# EAGLE schematic Logic Board (EAGLE 8.3.2)

## Sheet 1 of 2
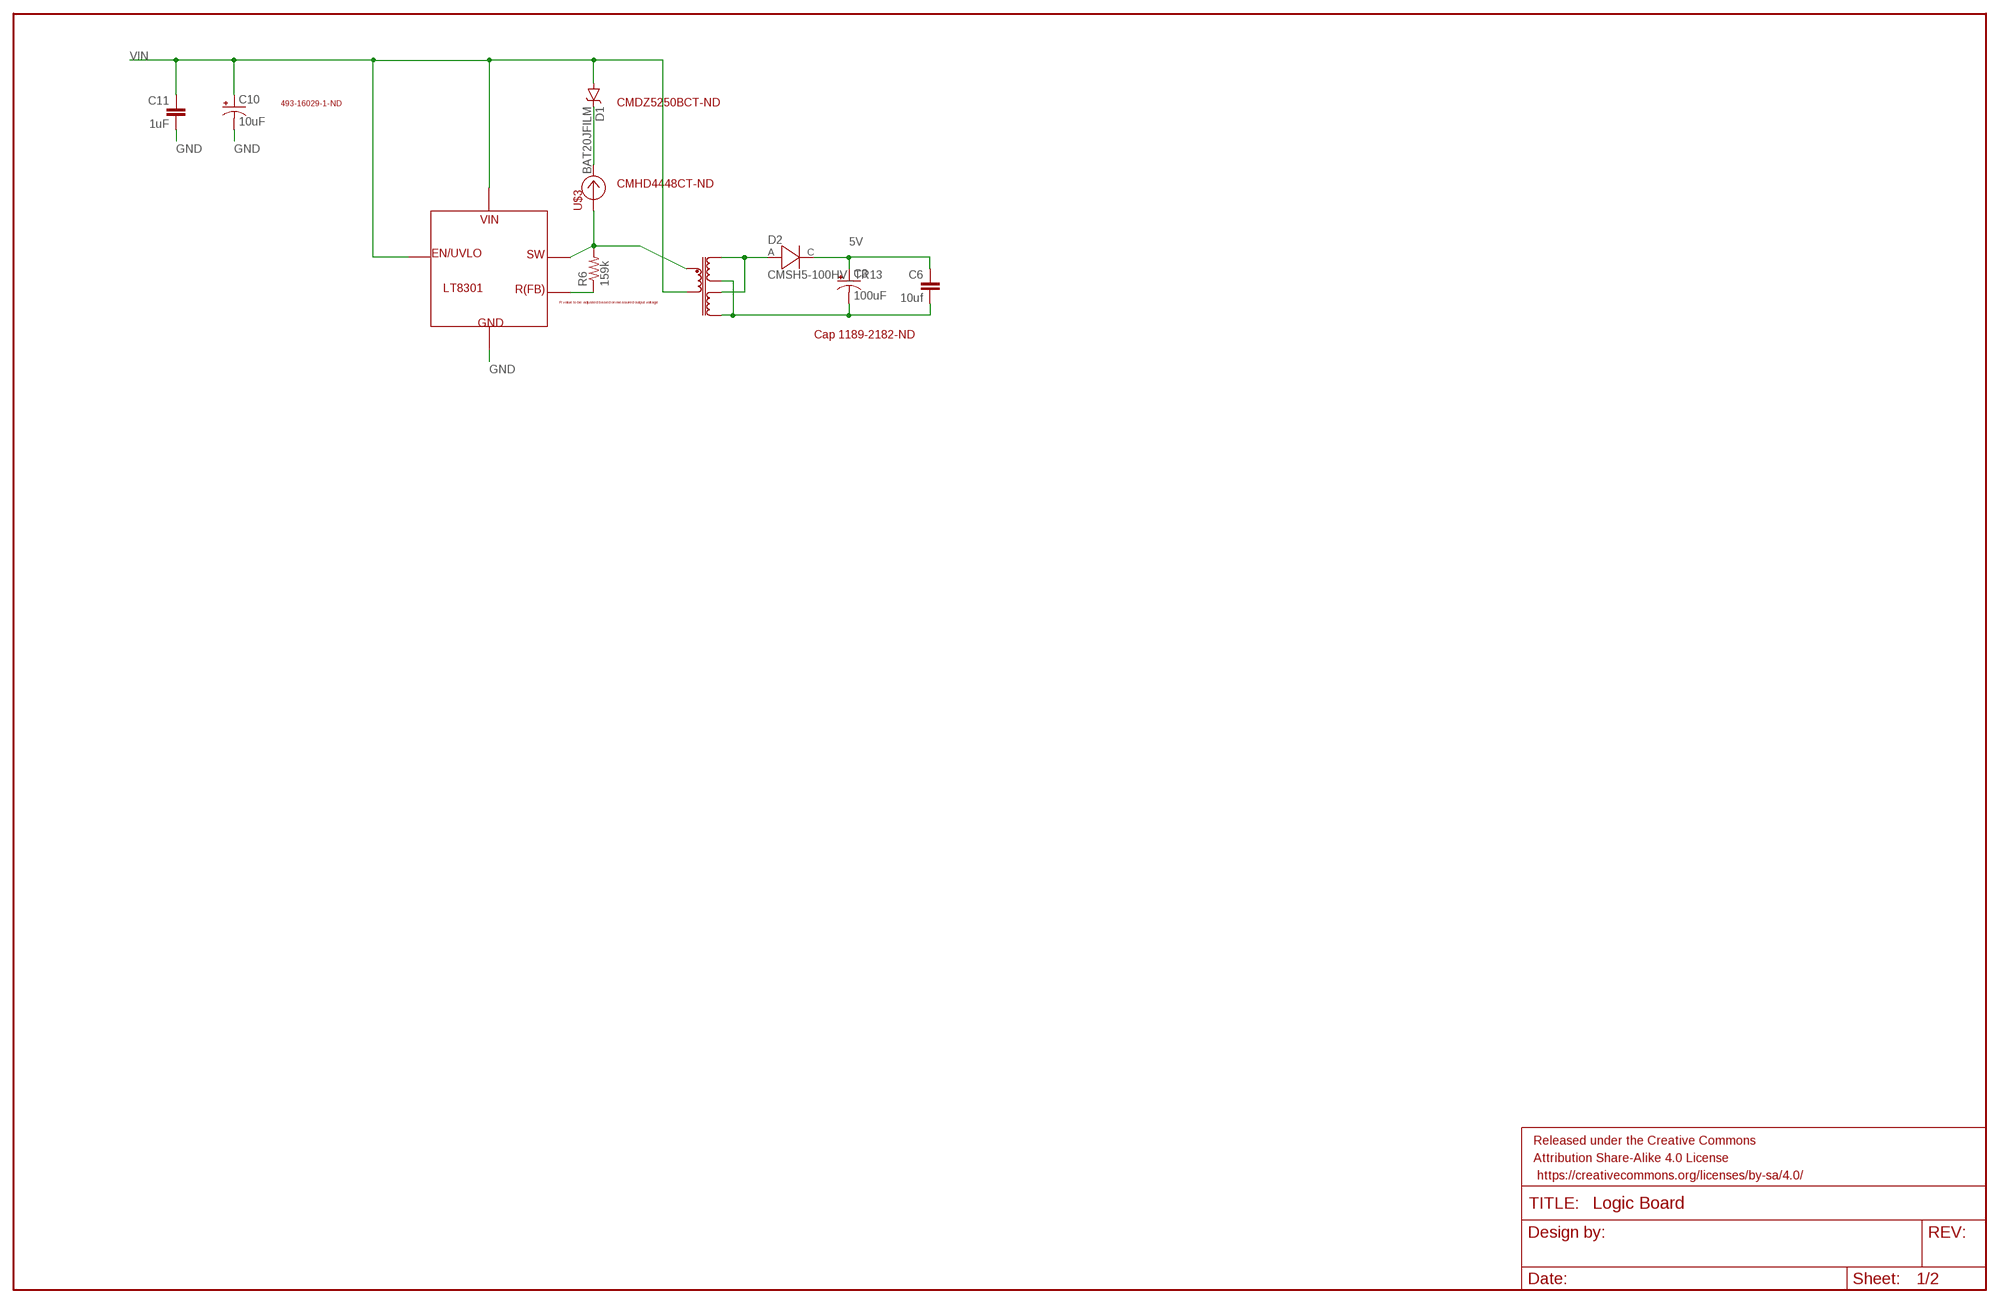
[diagram p0: schematic, sheet 1]

### Parts
C3  100uF  100UF-POLAR-RADIAL-2.5MM-25V-20%  [CPOL-RADIAL-2.5MM-6.5MM]
C6  10uf  C-EUC0805  [C0805]
C10  10uF  CAP_POLPTH1  [CPOL-RADIAL-100UF-25V]
C11  1uF  C-EUC0805  [C0805]
D1  BAT20JFILM  [SOD-323]
D2  CMSH5-100HV_TR13  [DIOM794X590X262L114X300N]
FRAME1  FRAME-LEDGER  [CREATIVE_COMMONS]
R6  159k  R-US_R0805  [R0805]
U$1  LT8301  [TSOT-23-5]
U$2  750313974  [750313974_TRANSFORMER]
U$3  AL5809-20S1-7  [SOD-123]

### Nets
5V: C3.1(+) C6.1 D2.C ; also sheet 2
GND: C10.2(-) C11.2 U$1.2.GND(GND) ; also sheet 2
N$1: R6.2 U$1.4.SW(SW) U$2.1 U$3.A
N$2: D2.A U$2.5 U$2.6
N$3: C3.2(-) C6.2 U$2.7 U$2.8
N$7: R6.1 U$1.3.RFB(RFB)
N$10: D1.C U$3.C
VIN: C10.1(+) C11.1 D1.A U$1.1.EN/UVLO(EN/UVLO) U$1.5.VIN(VIN) U$2.4

### Notes on the sheet
- 493-16029-1-ND | CMDZ5250BCT-ND
- CMHD4448CT-ND
- R value to be adjusted based on measured output voltage
- Cap 1189-2182-ND

## Sheet 2 of 2
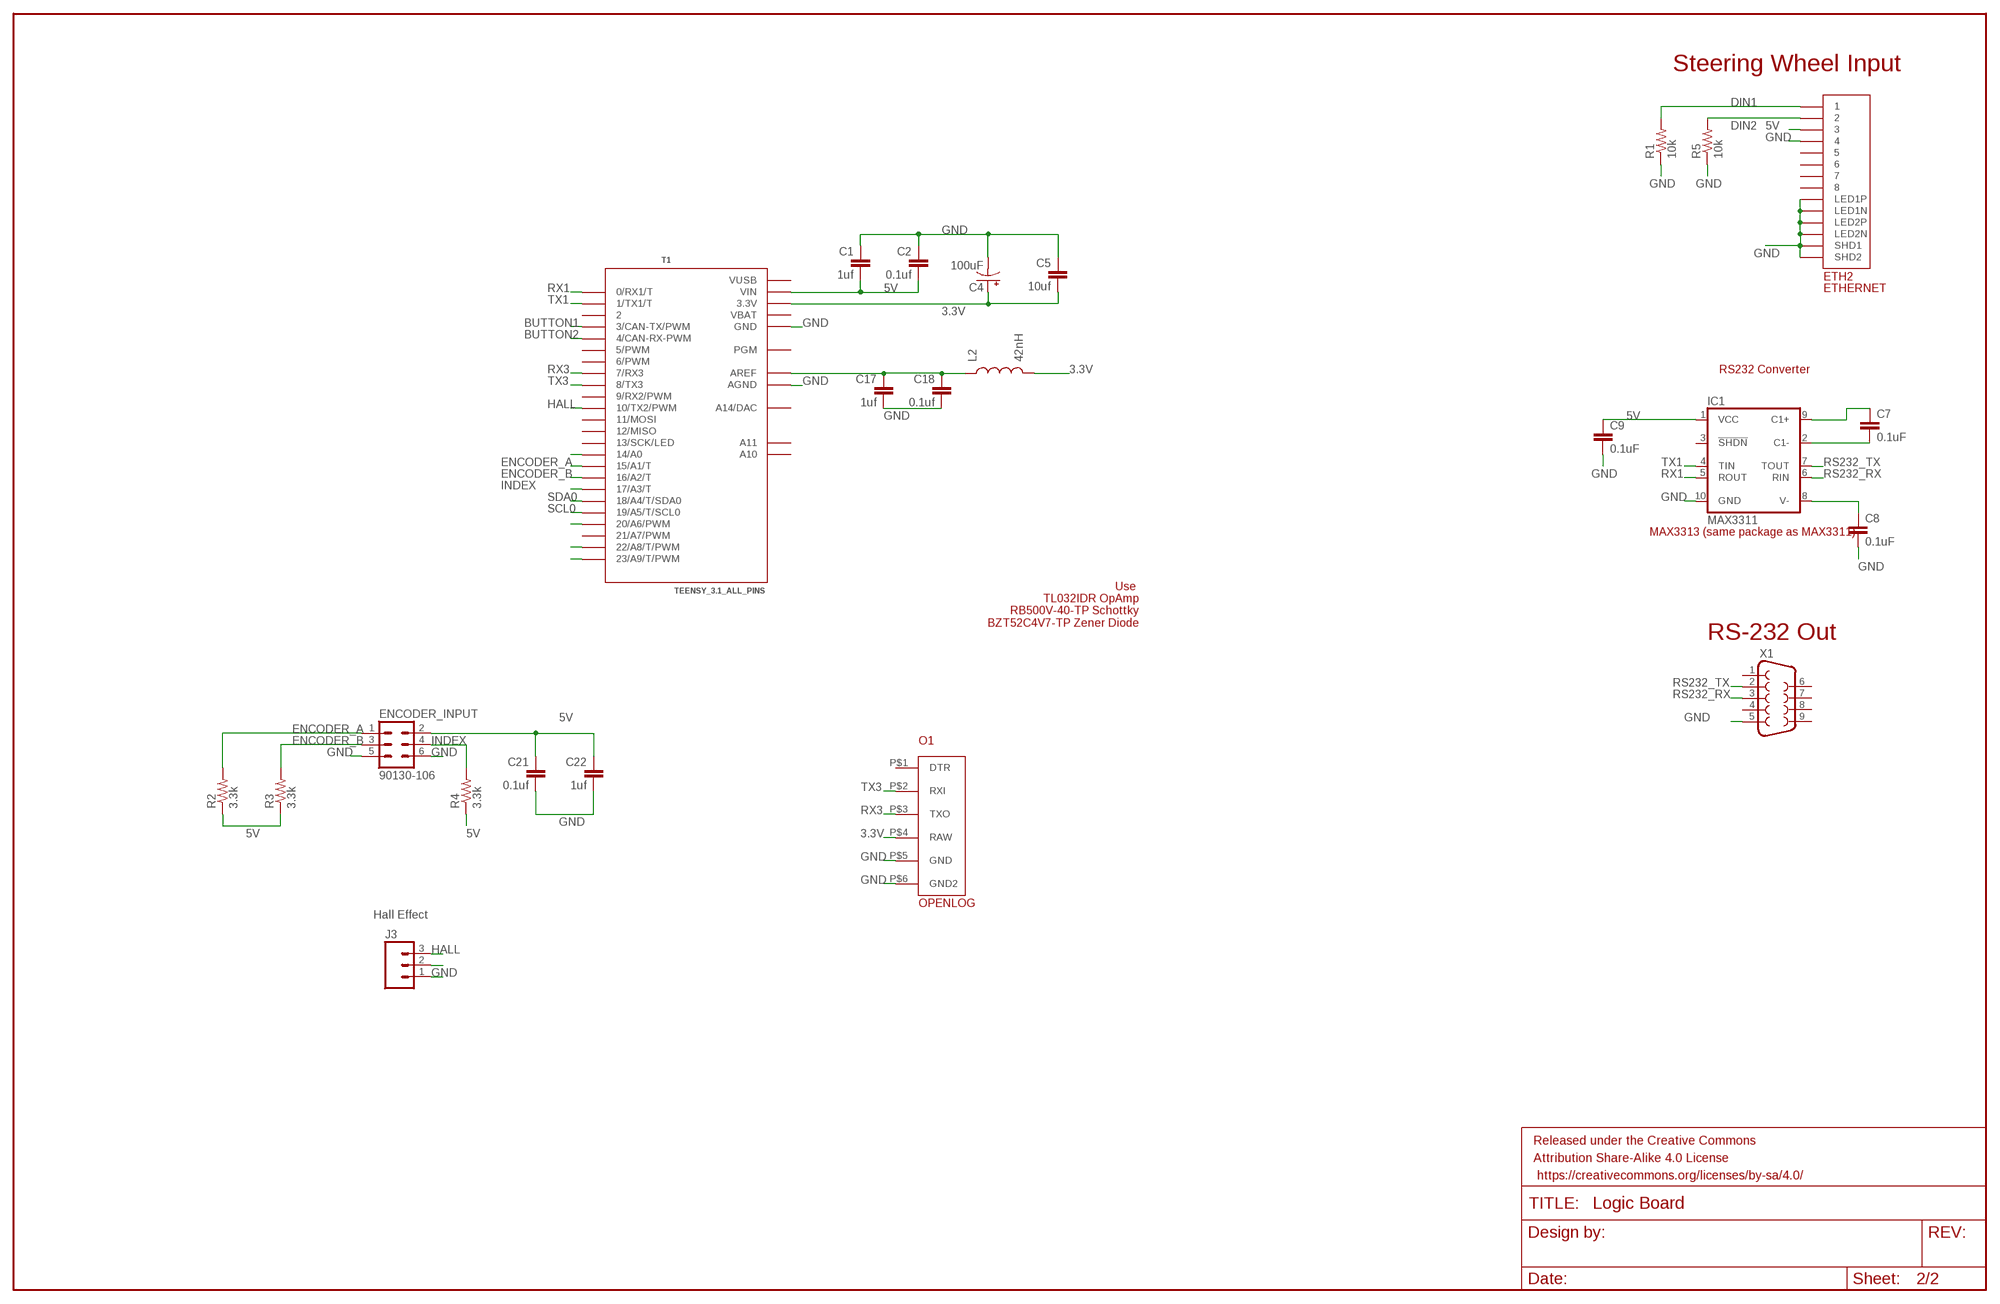
[diagram p1: schematic, sheet 2]

### Parts
C1  1uf  C-EUC0805  [C0805]
C2  0.1uf  C-EUC0805  [C0805]
C4  100uF  100UF-POLAR-RADIAL-2.5MM-25V-20%  [CPOL-RADIAL-2.5MM-6.5MM]
C5  10uf  C-EUC0805  [C0805]
C7  0.1uF  CAP0805  [0805]
C8  0.1uF  CAP0805  [0805]
C9  0.1uF  CAP0805  [0805]
C17  1uf  C-EUC0805  [C0805]
C18  0.1uf  C-EUC0805  [C0805]
C21  0.1uf  C-EUC0805  [C0805]
C22  1uf  C-EUC0805  [C0805]
ENCODER_INPUT  90130-106  [90130-1?06]
ETH2  ETHERNET  [A122645-ND]
FRAME2  FRAME-LEDGER  [CREATIVE_COMMONS]
IC1  MAX3311  [UMAX10]
J3  M03PTH  [1X03]
L2  42nH  INDUCTOR0805  [0805]
O1  OPENLOG  [OPENLOG]
R1  10k  RESISTOR0805-RES  [0805]
R2  3.3k  R-US_R0805  [R0805]
R3  3.3k  R-US_R0805  [R0805]
R4  3.3k  R-US_R0805  [R0805]
R5  10k  RESISTOR0805-RES  [0805]
T1  TEENSY_3.1_ALL_PINS  [TEENSY3-ALL_PINS]
X1  F09HP  [F09HP]

### Nets
3.3V: C4.1(+) C5.2 L2.2 O1.P$4(RAW) T1.3.3V T1.3.3V1(3.3V)
5V: C1.2 C2.2 C9.1 C21.1 C22.1 ENCODER_INPUT.2 ETH2.P$3 IC1.1(VCC) J3.2 R2.1 R3.1 R4.1 T1.VIN ; also sheet 1
BUTTON1: T1.3(3/CAN-TX/PWM)
BUTTON2: T1.4(4/CAN-RX-PWM)
COAST_ENABLE: T1.20/A6(20/A6/PWM)
CURRENT_FEEDBACK: T1.14/A0
DIN1: ETH2.P$1 R1.2
DIN2: ETH2.P$2 R5.2
ENCODER_A: ENCODER_INPUT.1 R2.2 T1.15/A1(15/A1/T)
ENCODER_B: ENCODER_INPUT.3 R3.2 T1.16/A2(16/A2/T)
GND: C1.1 C2.1 C4.2(-) C5.1 C8.2 C9.2 C17.2 C18.2 C21.2 C22.2 ENCODER_INPUT.5 ENCODER_INPUT.6 ETH2.P$4 ETH2.P$9(LED1N) ETH2.P$10(LED1P) ETH2.P$11(LED2N) ETH2.P$12(LED2P) ETH2.P$13(SHD1) ETH2.P$14(SHD2) IC1.10(GND) J3.1 O1.P$5(GND) O1.P$6(GND2) R1.1 R5.1 T1.AGND T1.GND T1.GND1(GND) X1.5 ; also sheet 1
HALL: J3.3 T1.10(10/TX2/PWM)
INDEX: ENCODER_INPUT.4 R4.2 T1.17/A3(17/A3/T)
N$4: C7.1 IC1.9(C1+)
N$5: C7.2 IC1.2(C1-)
N$6: C8.1 IC1.8(V-)
N$9: C17.1 C18.1 L2.1 T1.AREF
RS232_RX: IC1.6(RIN) X1.3
RS232_TX: IC1.7(TOUT) X1.2
RX1: IC1.5(ROUT) T1.0(0/RX1/T)
RX3: O1.P$3(TXO) T1.7(7/RX3)
SCL0: T1.19/A5(19/A5/T/SCL0)
SDA0: T1.18/A4(18/A4/T/SDA0)
SUPPLY_VOLTAGE: T1.22/A8(22/A8/T/PWM)
TEENSY_FET_DRIVER_SIGNAL: T1.23/A9(23/A9/T/PWM)
TX1: IC1.4(TIN) T1.1(1/TX1/T)
TX3: O1.P$2(RXI) T1.8(8/TX3)
Unconnected: ETH2.P$5 ETH2.P$6 ETH2.P$7 ETH2.P$8 IC1.3(!SHDN) O1.P$1(DTR) T1.2 T1.5(5/PWM) T1.6(6/PWM) T1.9(9/RX2/PWM) T1.11(11/MOSI) T1.12(12/MISO) T1.13(13/SCK/LED) T1.21/A7(21/A7/PWM) T1.A10 T1.A11 T1.PGM T1.RESET/DAC(A14/DAC) X1.1 X1.4 X1.6 X1.7 X1.8 X1.9

### Notes on the sheet
- Steering Wheel Input
- RS232 Converter
- MAX3313 (same package as MAX3311)
- Use 
  TL032IDR OpAmp
  RB500V-40-TP Schottky
  BZT52C4V7-TP Zener Diode
- RS-232 Out
- Hall Effect

## Power pins joined to a net without a drawn wire
VBAT: T1.VBAT
VUSB: T1.VUSB

## Library data of the parts
C1 C2 C5 C6 C11 C17 C18 C21 C22 = resistor:C-EU: CAPACITOR, European symbol
C3 C4 = SparkFun-Capacitors:100UF-POLAR: 100µF polarized capacitors A capacitor is a passive two-terminal electrical component used to store electrical energy temporarily in an electric field.; PROD_ID: CAP-08439
C7-C9 = SparkFun-Passives:CAP: Capacitor Standard 0603 ceramic capacitor, and 0.1" leaded capacitor.
C10 = SparkFun-Passives:CAP_POL: Capacitor Polarized These are standard SMD and PTH capacitors. Normally 10uF, 47uF, and 100uF in electrolytic and tantalum varieties. Always verify the external diameter of the through hole cap, it varies with capacity, voltage, and manufacturer. The EIA devices should be standard.
D1 = SparkFun-DiscreteSemi:BAT20JFILM: 23V, 1A Schottky diode, SOD-323 package; PROD_ID: DIO-11623
D2 = CMSH5-100HV_TR13:CMSH5-100HV_TR13: CMSH Series 70 V 5 A Surface Mount Schottky Barrier Rectifier - DO-214AB; DESCRIPTION: DIODE SCHOTTKY 100V 5A SMC; DIGI-KEY_PART_NUMBER: CMSH5-100HVCT-ND; DIGI-KEY_PURCHASE_URL: https://www.digikey.ca/product-detail/en/central-semiconductor-corp/CMSH5-100HV-TR13/CMSH5-100HVCT-ND/4807122?WT.z_cid=ref_snapeda&utm_source=snapeda&utm_medium=aggregator&utm_campaign=buynow; MF: Central Semiconductor; MP: CMSH5-100HV TR13; PACKAGE: DO-214 Central Semiconductor
ENCODER_INPUT = con-molex-c-grid:90130-1?06: C-Grid III
ETH2 = ETHERNET:ETHERNET: Ethernet port with 2 leds. digikey number A122645-ND
FRAME1 FRAME2 = SparkFun-Aesthetics:FRAME-LEDGER: Schematic Frame Standard 11x14 US Ledger frame
IC1 = maxim:MAX3311: 460kbps, 1µA Supply Current, RS-232-Compatible Transceivers in µMAX Source: http://www.maxim-ic.com .. MAX3311-MAX3313.pdf; MF: MAXIM; MPN: MAX3311ECUB+; OC_FARNELL: 1379937; OC_NEWARK: 67K4953
J3 = SparkFun-Connectors:M03: Header 3 Standard 3-pin 0.1" header. Use with straight break away headers (SKU : PRT-00116), right angle break away headers (PRT-00553), swiss pins (PRT-00743), machine pins (PRT-00117), and female headers (PRT-00115). Molex polarized connector foot print use with SKU : PRT-08232 with associated crimp pins and housings.
L2 = SparkFun (2015_10_14 22_27_04 UTC):INDUCTOR: Inductors Basic Inductor/Choke - 0603 and 1206. Footprints are not proven and vary greatly between part numbers.
O1 = openlog:OPENLOG
R1 R5 = SparkFun-Resistors:RESISTOR: Resistor Basic schematic elements and footprints for 0603, 1206, and PTH resistors.
R2-R4 R6 = resistor:R-US_: RESISTOR, American symbol
T1 = Teensy_3_and_LC_Series_Boards_v1.1:TEENSY_3.1_ALL_PINS: Footprint for Teensy 3.1 or 3.2 board using all through-holes, i.e. the entire perimeter plus the 4 through-holes inboard (A10,A11,AREF, VUSB)
U$1 = MotorControllerEagleLibrary:LT8301
U$2 = MotorControllerEagleLibrary:750313974
U$3 = MotorControllerEagleLibrary:AL5809-20S1-7
X1 = con-subd:F09: SUB-D; OC_FARNELL: unknown; OC_NEWARK: unknown